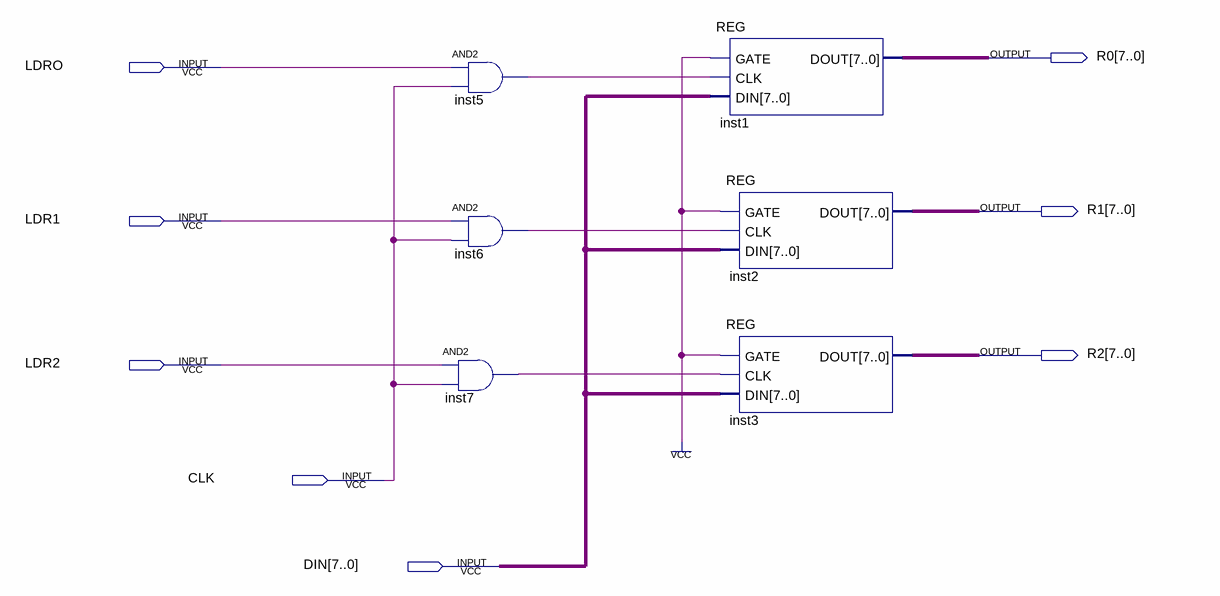
[diagram p0: schematic sheet]
// Quartus schematic registerfile.bdf as structural Verilog: 6 symbols, 8 pins
module registerfile (
  input  LDRO,
  input  LDR1,
  input  LDR2,
  input  CLK,
  input  [7:0] DIN,
  output [7:0] R0,
  output [7:0] R1,
  output [7:0] R2
);

  wire inst5_out, inst6_out, inst7_out;

  and inst5 (inst5_out, LDRO, CLK);
  and inst6 (inst6_out, LDR1, CLK);
  and inst7 (inst7_out, LDR2, CLK);
  REG inst1 (.GATE(1'b1), .CLK(inst5_out), .DIN(DIN), .DOUT(R0));
  REG inst2 (.GATE(1'b1), .CLK(inst6_out), .DIN(DIN), .DOUT(R1));
  REG inst3 (.GATE(1'b1), .CLK(inst7_out), .DIN(DIN), .DOUT(R2));
endmodule
